# EAGLE schematic eeZeeLED (EAGLE 6.4)
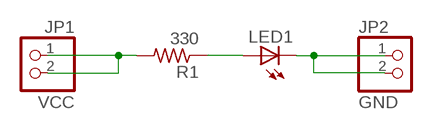
[diagram p0: schematic, sheet 1]

## Parts
JP1  VCC  PINHD-1X02_2.54-S  [1X02-S]
JP2  GND  PINHD-1X02_2.54-S  [1X02-S]
LED1  LEDCHIPLED_1206  [CHIPLED_1206]
R1  330  R-US_R0603  [R0603]

## Nets
N$1: LED1.A R1.1
N$2: JP2.1 JP2.2 LED1.C
N$3: JP1.1 JP1.2 R1.2

## Library data of the parts
JP1 JP2 = pinhead-2:PINHD-1X02: PIN HEADER
LED1 = bt_opto:LED: LED Various packages
R1 = rcl:R-US_: RESISTOR, American symbol